# EAGLE design hbs (EAGLE 9.3.2)
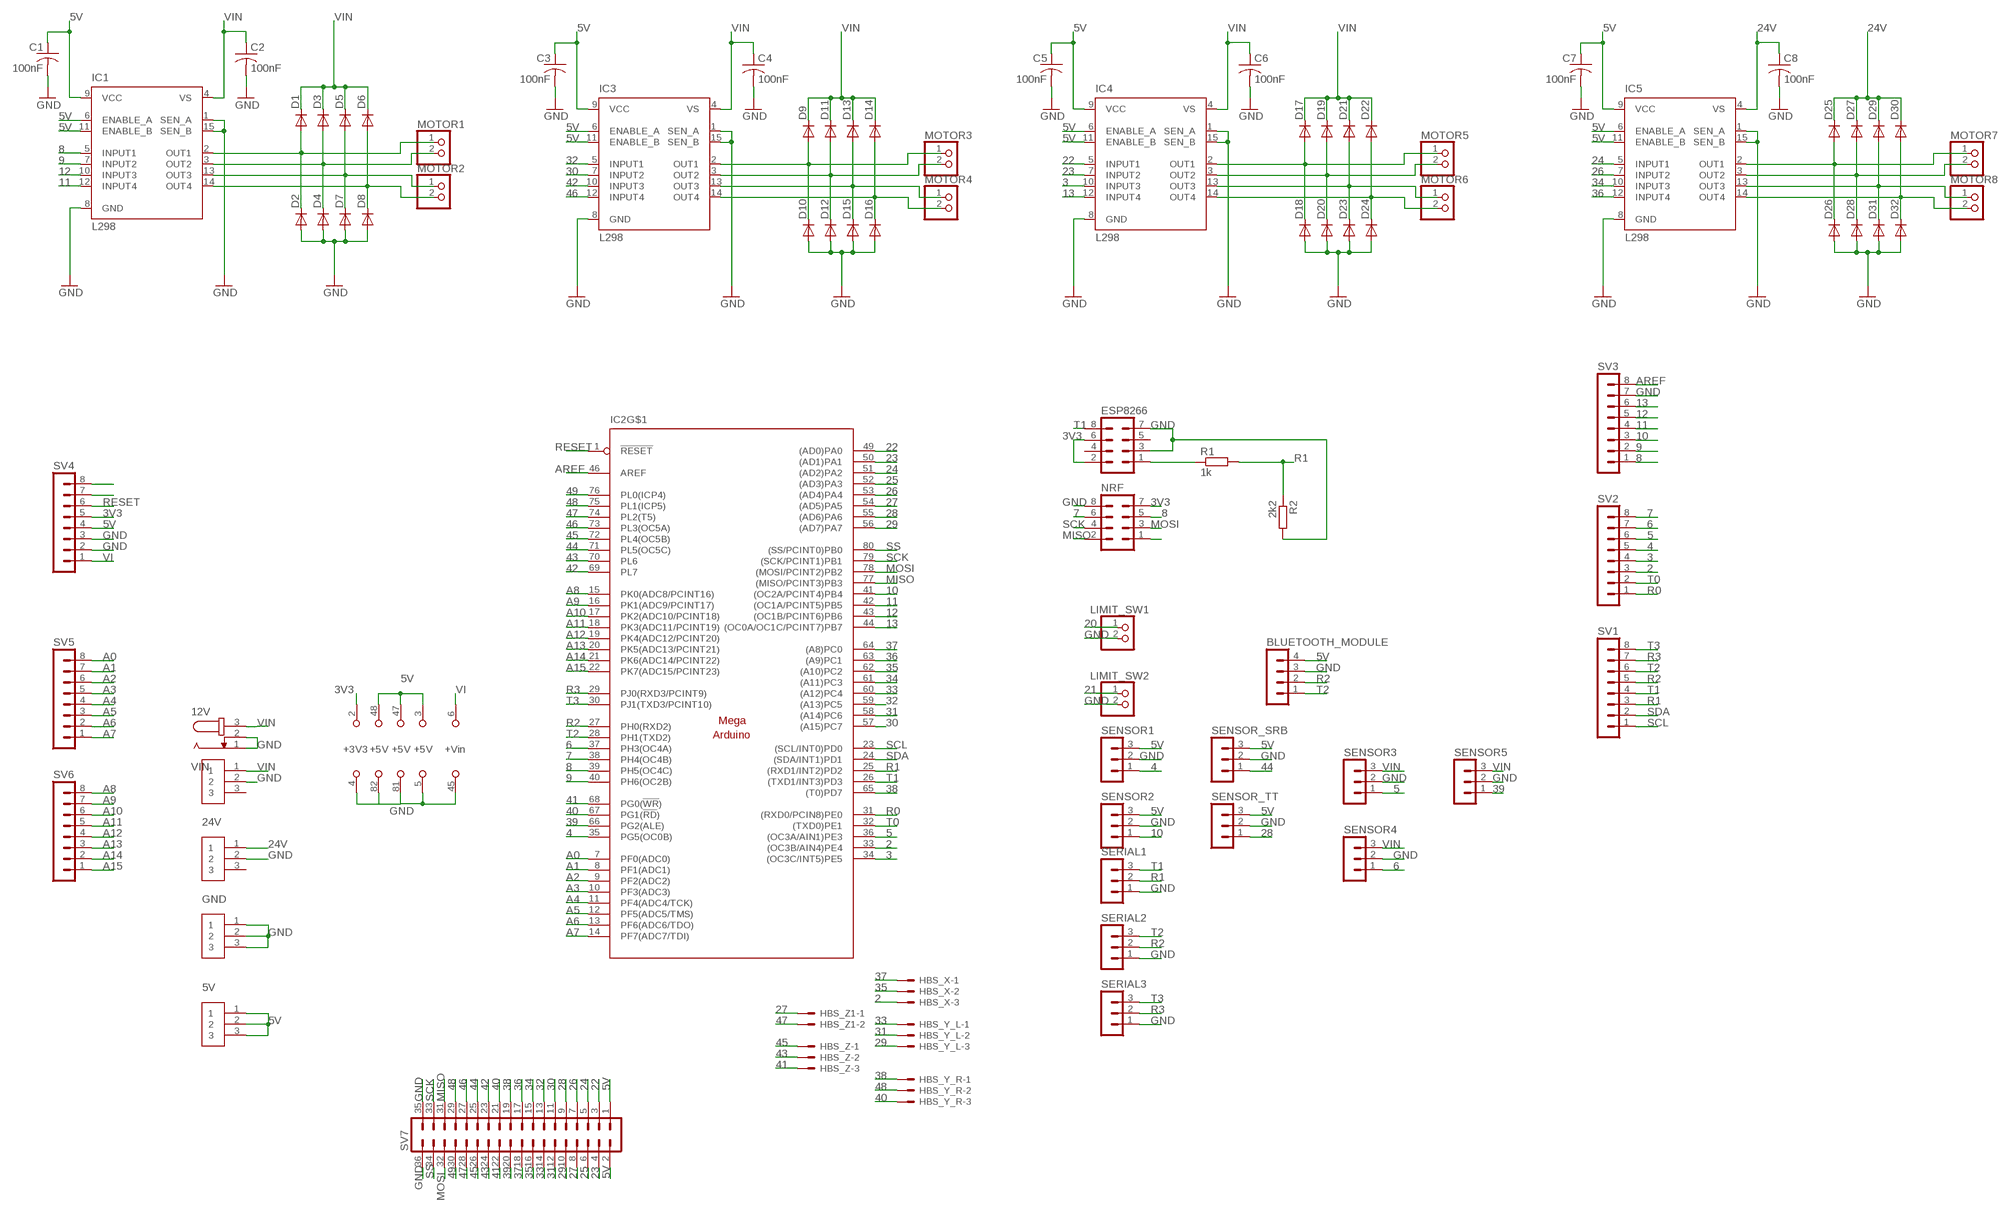
[diagram p0: schematic, sheet 1]

## Parts
5V  691311500003  [TERMINALBLOCK_PLUGGABLE-3-5.08MM]
12V  JACK-PLUG0  [SPC4077]
24V  691311500003  [TERMINALBLOCK_PLUGGABLE-3-5.08MM]
BLUETOOTH_MODULE  MA04-1  [MA04-1]
C1  100nF  C-US050-024X044  [C050-024X044]
C2  100nF  C-US050-024X044  [C050-024X044]
C3  100nF  C-US050-024X044  [C050-024X044]
C4  100nF  C-US050-024X044  [C050-024X044]
C5  100nF  C-US050-024X044  [C050-024X044]
C6  100nF  C-US050-024X044  [C050-024X044]
C7  100nF  C-US050-024X044  [C050-024X044]
C8  100nF  C-US050-024X044  [C050-024X044]
D1  DIODE-D-5  [D-5]
D2  DIODE-D-5  [D-5]
D3  DIODE-D-5  [D-5]
D4  DIODE-D-5  [D-5]
D5  DIODE-D-5  [D-5]
D6  DIODE-D-5  [D-5]
D7  DIODE-D-5  [D-5]
D8  DIODE-D-5  [D-5]
D9  DIODE-D-5  [D-5]
D10  DIODE-D-5  [D-5]
D11  DIODE-D-5  [D-5]
D12  DIODE-D-5  [D-5]
D13  DIODE-D-5  [D-5]
D14  DIODE-D-5  [D-5]
D15  DIODE-D-5  [D-5]
D16  DIODE-D-5  [D-5]
D17  DIODE-D-5  [D-5]
D18  DIODE-D-5  [D-5]
D19  DIODE-D-5  [D-5]
D20  DIODE-D-5  [D-5]
D21  DIODE-D-5  [D-5]
D22  DIODE-D-5  [D-5]
D23  DIODE-D-5  [D-5]
D24  DIODE-D-5  [D-5]
D25  DIODE-D-5  [D-5]
D26  DIODE-D-5  [D-5]
D27  DIODE-D-5  [D-5]
D28  DIODE-D-5  [D-5]
D29  DIODE-D-5  [D-5]
D30  DIODE-D-5  [D-5]
D31  DIODE-D-5  [D-5]
D32  DIODE-D-5  [D-5]
ESP8266  MA04-2  [MA04-2]
GND  691311500003  [TERMINALBLOCK_PLUGGABLE-3-5.08MM]
HBS_X  JST-XH-03-PIN-LONG-PAD  [JST-XH-03-PACKAGE-LONG-PAD]
HBS_Y_L  JST-XH-03-PIN-LONG-PAD  [JST-XH-03-PACKAGE-LONG-PAD]
HBS_Y_R  JST-XH-03-PIN-LONG-PAD  [JST-XH-03-PACKAGE-LONG-PAD]
HBS_Z  JST-XH-03-PIN-LONG-PAD  [JST-XH-03-PACKAGE-LONG-PAD]
HBS_Z1  JST-XH-02-PIN-LONG-PAD  [JST-XH-02-PACKAGE-LONG-PAD]
IC1  L298  [MULTIWATT-15]
IC2  MEGAARDUINO_21  [MEGA_ARDUINO_1]
IC3  L298  [MULTIWATT-15]
IC4  L298  [MULTIWATT-15]
IC5  L298  [MULTIWATT-15]
LIMIT_SW1  PINHD-1X2  [1X02]
LIMIT_SW2  PINHD-1X2  [1X02]
MOTOR1  PINHD-1X2  [1X02]
MOTOR2  PINHD-1X2  [1X02]
MOTOR3  PINHD-1X2  [1X02]
MOTOR4  PINHD-1X2  [1X02]
MOTOR5  PINHD-1X2  [1X02]
MOTOR6  PINHD-1X2  [1X02]
MOTOR7  PINHD-1X2  [1X02]
MOTOR8  PINHD-1X2  [1X02]
NRF  MA04-2  [MA04-2]
R1  1k  R-EU_0204/7  [0204/7]
R2  2k2  R-EU_0204/7  [0204/7]
SENSOR1  MA03-1  [MA03-1]
SENSOR2  MA03-1  [MA03-1]
SENSOR3  MA03-1  [MA03-1]
SENSOR4  MA03-1  [MA03-1]
SENSOR5  MA03-1  [MA03-1]
SENSOR_SRB  MA03-1  [MA03-1]
SENSOR_TT  MA03-1  [MA03-1]
SERIAL1  MA03-1  [MA03-1]
SERIAL2  MA03-1  [MA03-1]
SERIAL3  MA03-1  [MA03-1]
SV1  MA08-1  [MA08-1]
SV2  MA08-1  [MA08-1]
SV3  MA08-1  [MA08-1]
SV4  MA08-1  [MA08-1]
SV5  MA08-1  [MA08-1]
SV6  MA08-1  [MA08-1]
SV7  MA18-2  [MA18-2]
VIN  691311500003  [TERMINALBLOCK_PLUGGABLE-3-5.08MM]

## Nets
2: HBS_X.3 IC2.33((OC3B/AIN4)PE4) SV2.3
3: IC2.34((OC3C/INT5)PE5) IC4.10(INPUT3) SV2.4
3V3: ESP8266.2 ESP8266.6 IC2.2(+3V3) NRF.7 SV4.5
4: IC2.35(PG5(OC0B)) SENSOR1.1 SV2.5
5: IC2.36((OC3A/AIN1)PE3) SENSOR3.1 SV2.6
5V: 5V.1 5V.2 5V.3 BLUETOOTH_MODULE.4 C1.1 C3.1 C5.1 C7.1 IC1.6(ENABLE_A) IC1.9(VCC) IC1.11(ENABLE_B) IC2.3(+5V) IC2.47(+5V) IC2.48(+5V) IC3.6(ENABLE_A) IC3.9(VCC) IC3.11(ENABLE_B) IC4.6(ENABLE_A) IC4.9(VCC) IC4.11(ENABLE_B) IC5.6(ENABLE_A) IC5.9(VCC) IC5.11(ENABLE_B) SENSOR1.3 SENSOR2.3 SENSOR_SRB.3 SENSOR_TT.3 SV4.4 SV7.1 SV7.2
6: IC2.37(PH3(OC4A)) SENSOR4.1 SV2.7
7: IC2.38(PH4(OC4B)) NRF.6 SV2.8
8: IC1.5(INPUT1) IC2.39(PH5(OC4C)) NRF.5 SV3.1
9: IC1.7(INPUT2) IC2.40(PH6(OC2B)) SV3.2
10: IC2.41((OC2A/PCINT4)PB4) SENSOR2.1 SV3.3
11: IC1.12(INPUT4) IC2.42((OC1A/PCINT5)PB5) SV3.4
12: IC1.10(INPUT3) IC2.43((OC1B/PCINT6)PB6) SV3.5
13: IC2.44((OC0A/OC1C/PCINT7)PB7) IC4.12(INPUT4) SV3.6
20: LIMIT_SW1.1
21: LIMIT_SW2.1
22: IC2.49((AD0)PA0) IC4.5(INPUT1) SV7.3
23: IC2.50((AD1)PA1) IC4.7(INPUT2) SV7.4
24: IC2.51((AD2)PA2) IC5.5(INPUT1) SV7.5
24V: 24V.1 C8.1 D25.C D27.C D29.C D30.C IC5.4(VS)
25: IC2.52((AD3)PA3) SV7.6
26: IC2.53((AD4)PA4) IC5.7(INPUT2) SV7.7
27: HBS_Z1.1 IC2.54((AD5)PA5) SV7.8
28: IC2.55((AD6)PA6) SENSOR_TT.1 SV7.9
29: HBS_Y_L.3 IC2.56((AD7)PA7) SV7.10
30: IC2.57((A15)PC7) IC3.7(INPUT2) SV7.11
31: HBS_Y_L.2 IC2.58((A14)PC6) SV7.12
32: IC2.59((A13)PC5) IC3.5(INPUT1) SV7.13
33: HBS_Y_L.1 IC2.60((A12)PC4) SV7.14
34: IC2.61((A11)PC3) IC5.10(INPUT3) SV7.15
35: HBS_X.2 IC2.62((A10)PC2) SV7.16
36: IC2.63((A9)PC1) IC5.12(INPUT4) SV7.17
37: HBS_X.1 IC2.64((A8)PC0) SV7.18
38: HBS_Y_R.1 IC2.65((T0)PD7) SV7.19
39: IC2.66(PG2(ALE)) SENSOR5.1 SV7.20
40: HBS_Y_R.3 IC2.67(PG1(!RD!)) SV7.21
41: HBS_Z.3 IC2.68(PG0(!WR!)) SV7.22
42: IC2.69(PL7) IC3.10(INPUT3) SV7.23
43: HBS_Z.2 IC2.70(PL6) SV7.24
44: IC2.71(PL5(OC5C)) SENSOR_SRB.1 SV7.25
45: HBS_Z.1 IC2.72(PL4(OC5B)) SV7.26
46: IC2.73(PL3(OC5A)) IC3.12(INPUT4) SV7.27
47: HBS_Z1.2 IC2.74(PL2(T5)) SV7.28
48: HBS_Y_R.2 IC2.75(PL1(ICP5)) SV7.29
49: IC2.76(PL0(ICP4)) SV7.30
A0: IC2.7(PF0(ADC0)) SV5.8
A1: IC2.8(PF1(ADC1)) SV5.7
A2: IC2.9(PF2(ADC2)) SV5.6
A3: IC2.10(PF3(ADC3)) SV5.5
A4: IC2.11(PF4(ADC4/TCK)) SV5.4
A5: IC2.12(PF5(ADC5/TMS)) SV5.3
A6: IC2.13(PF6(ADC6/TDO)) SV5.2
A7: IC2.14(PF7(ADC7/TDI)) SV5.1
A8: IC2.15(PK0(ADC8/PCINT16)) SV6.8
A9: IC2.16(PK1(ADC9/PCINT17)) SV6.7
A10: IC2.17(PK2(ADC10/PCINT18)) SV6.6
A11: IC2.18(PK3(ADC11/PCINT19)) SV6.5
A12: IC2.19(PK4(ADC12/PCINT20)) SV6.4
A13: IC2.20(PK5(ADC13/PCINT21)) SV6.3
A14: IC2.21(PK6(ADC14/PCINT22)) SV6.2
A15: IC2.22(PK7(ADC15/PCINT23)) SV6.1
AREF: IC2.46(AREF) SV3.8
GND: 12V.1 12V.2 24V.2 BLUETOOTH_MODULE.3 C1.2 C2.2 C3.2 C4.2 C5.2 C6.2 C7.2 C8.2 D2.A D4.A D7.A D8.A D10.A D12.A D15.A D16.A D18.A D20.A D23.A D24.A D26.A D28.A D31.A D32.A ESP8266.3 ESP8266.7 GND.1 GND.2 GND.3 IC1.1(SEN_A) IC1.8(GND) IC1.15(SEN_B) IC2.4(GND) IC2.5(GND) IC2.45(GND) IC2.81(GND) IC2.82(GND) IC3.1(SEN_A) IC3.8(GND) IC3.15(SEN_B) IC4.1(SEN_A) IC4.8(GND) IC4.15(SEN_B) IC5.1(SEN_A) IC5.8(GND) IC5.15(SEN_B) LIMIT_SW1.2 LIMIT_SW2.2 NRF.8 R2.2 SENSOR1.2 SENSOR2.2 SENSOR3.2 SENSOR4.2 SENSOR5.2 SENSOR_SRB.2 SENSOR_TT.2 SERIAL1.1 SERIAL2.1 SERIAL3.1 SV3.7 SV4.2 SV4.3 SV7.35 SV7.36 VIN.2
MISO: IC2.77((MISO/PCINT3)PB3) NRF.2 SV7.31
MOSI: IC2.78((MOSI/PCINT2)PB2) NRF.3 SV7.32
N$1: D1.A D2.C IC1.2(OUT1) MOTOR1.1
N$2: D3.A D4.C IC1.3(OUT2) MOTOR1.2
N$3: D6.A D8.C IC1.14(OUT4) MOTOR2.2
N$4: D5.A D7.C IC1.13(OUT3) MOTOR2.1
N$5: ESP8266.1 R1.1
N$7: D9.A D10.C IC3.2(OUT1) MOTOR3.1
N$8: D11.A D12.C IC3.3(OUT2) MOTOR3.2
N$9: D14.A D16.C IC3.14(OUT4) MOTOR4.2
N$10: D13.A D15.C IC3.13(OUT3) MOTOR4.1
N$11: D17.A D18.C IC4.2(OUT1) MOTOR5.1
N$12: D19.A D20.C IC4.3(OUT2) MOTOR5.2
N$13: D22.A D24.C IC4.14(OUT4) MOTOR6.2
N$14: D21.A D23.C IC4.13(OUT3) MOTOR6.1
N$15: D25.A D26.C IC5.2(OUT1) MOTOR7.1
N$16: D27.A D28.C IC5.3(OUT2) MOTOR7.2
N$17: SV4.8
N$18: SV4.7
N$19: D30.A D32.C IC5.14(OUT4) MOTOR8.2
N$20: D29.A D31.C IC5.13(OUT3) MOTOR8.1
N$22: NRF.1
R0: IC2.31((RXD0/PCIN8)PE0) SV2.1
R1: IC2.25((RXD1/INT2)PD2) R1.2 R2.1 SERIAL1.2 SV1.3
R2: BLUETOOTH_MODULE.2 IC2.27(PH0(RXD2)) SERIAL2.2 SV1.5
R3: IC2.29(PJ0(RXD3/PCINT9)) SERIAL3.2 SV1.7
RESET: IC2.1(!RESET) SV4.6
SCK: IC2.79((SCK/PCINT1)PB1) NRF.4 SV7.33
SCL: IC2.23((SCL/INT0)PD0) SV1.1
SDA: IC2.24((SDA/INT1)PD1) SV1.2
SS: IC2.80((SS/PCINT0)PB0) SV7.34
T0: IC2.32((TXD0)PE1) SV2.2
T1: ESP8266.8 IC2.26((TXD1/INT3)PD3) SERIAL1.3 SV1.4
T2: BLUETOOTH_MODULE.1 IC2.28(PH1(TXD2)) SERIAL2.3 SV1.6
T3: IC2.30(PJ1(TXD3/PCINT10)) SERIAL3.3 SV1.8
VI: IC2.6(+VIN) SV4.1
VIN: 12V.3 C2.1 C4.1 C6.1 D1.C D3.C D5.C D6.C D9.C D11.C D13.C D14.C D17.C D19.C D21.C D22.C IC1.4(VS) IC3.4(VS) IC4.4(VS) SENSOR3.3 SENSOR4.3 SENSOR5.3 VIN.1
Unconnected: 24V.3 ESP8266.4 ESP8266.5 VIN.3

## Library data of the parts
5V 24V GND VIN = Terminal Blocks:691311500003: 5.08MM OPEN VERTICAL PCB HEADER WR-TBL Manufacturer's datasheet <https://katalog.we-online.com/em/datasheet/6913115000xx.pdf>; CREATED_BY: PCBLayout.com; DIGIKEY_PART_NO: 732-2053-ND; MANUFACTURER: WURTH ELEKTRONIK; MPN: 691311500003
12V = con-jack:JACK-PLUG: DC POWER JACK Power Jack, DC, Right Angle, Through Hole, Rated 5A at 16VDC, PC Terminals Distributor: Farnell (www.Farnell.de) Drawing: 84N1161.pdf / 84N1162.pdf Manufacturer: SPC Technology (www.spctechnology.com) Type: SPC4077 / SPC 4078; OC_FARNELL: unknown; OC_NEWARK: unknown
BLUETOOTH_MODULE = con-lstb:MA04-1: PIN HEADER; OC_FARNELL: unknown; OC_NEWARK: unknown
C1-C8 = rcl:C-US: CAPACITOR, American symbol
D1-D32 = diode:DIODE-: DIODE
ESP8266 NRF = con-lstb:MA04-2: PIN HEADER; OC_FARNELL: unknown; OC_NEWARK: unknown
HBS_X HBS_Y_L HBS_Y_R HBS_Z = Rembrandt Electronics - JST XH Connectors v1-0:JST-XH-03-PIN: JST XH Connector 2 Pin Wire to board connector. Pitch: 2,54 mm, (0.100") Number of pins: 3 Created by Rembrandt Electronics www.rembrandtelectronics.com
HBS_Z1 = Rembrandt Electronics - JST XH Connectors v1-0:JST-XH-02-PIN: JST XH Connector 2 Pin Wire to board connector. Pitch: 2,54 mm, (0.100") Number of pins: 2 Created by Rembrandt Electronics www.rembrandtelectronics.com
IC1 IC3-IC5 = st-microelectronics:L298: DUAL FULL-BRIDGE DRIVER; MPN: L298N; OC_FARNELL: 1589425; OC_NEWARK: 32M1527
IC2 = arduino:MEGAARDUINO_2: The Arduino Mega is a microcontroller board based on the ATmega1280. - 54 digital input/output pins (of which 14 can be used as PWM outputs) - 16 analog inputs - 4 UARTs (hardware serial ports) - 16 MHz crystal oscillator - USB connection - power jack - ICSP header - reset button It contains everything needed to support the microcontroller; simply connect it to a computer with a USB cable or power it with a AC-to-DC adapter or battery to get started. The Mega is compatible with most shields designed for the Arduino Duemilanove or Diecimila. http://arduino.cc/en/Main/ArduinoBoardMega
LIMIT_SW1 LIMIT_SW2 MOTOR1-MOTOR8 = pinhead:PINHD-1X2: PIN HEADER
R1 R2 = rcl:R-EU_: RESISTOR, European symbol; SPICEPREFIX: R
SENSOR1-SENSOR5 SENSOR_SRB SENSOR_TT SERIAL1-SERIAL3 = con-lstb:MA03-1: PIN HEADER; OC_FARNELL: unknown; OC_NEWARK: unknown
SV1-SV6 = con-lstb:MA08-1: PIN HEADER; OC_FARNELL: unknown; OC_NEWARK: unknown
SV7 = con-lstb:MA18-2: PIN HEADER; OC_FARNELL: unknown; OC_NEWARK: unknown

## Board
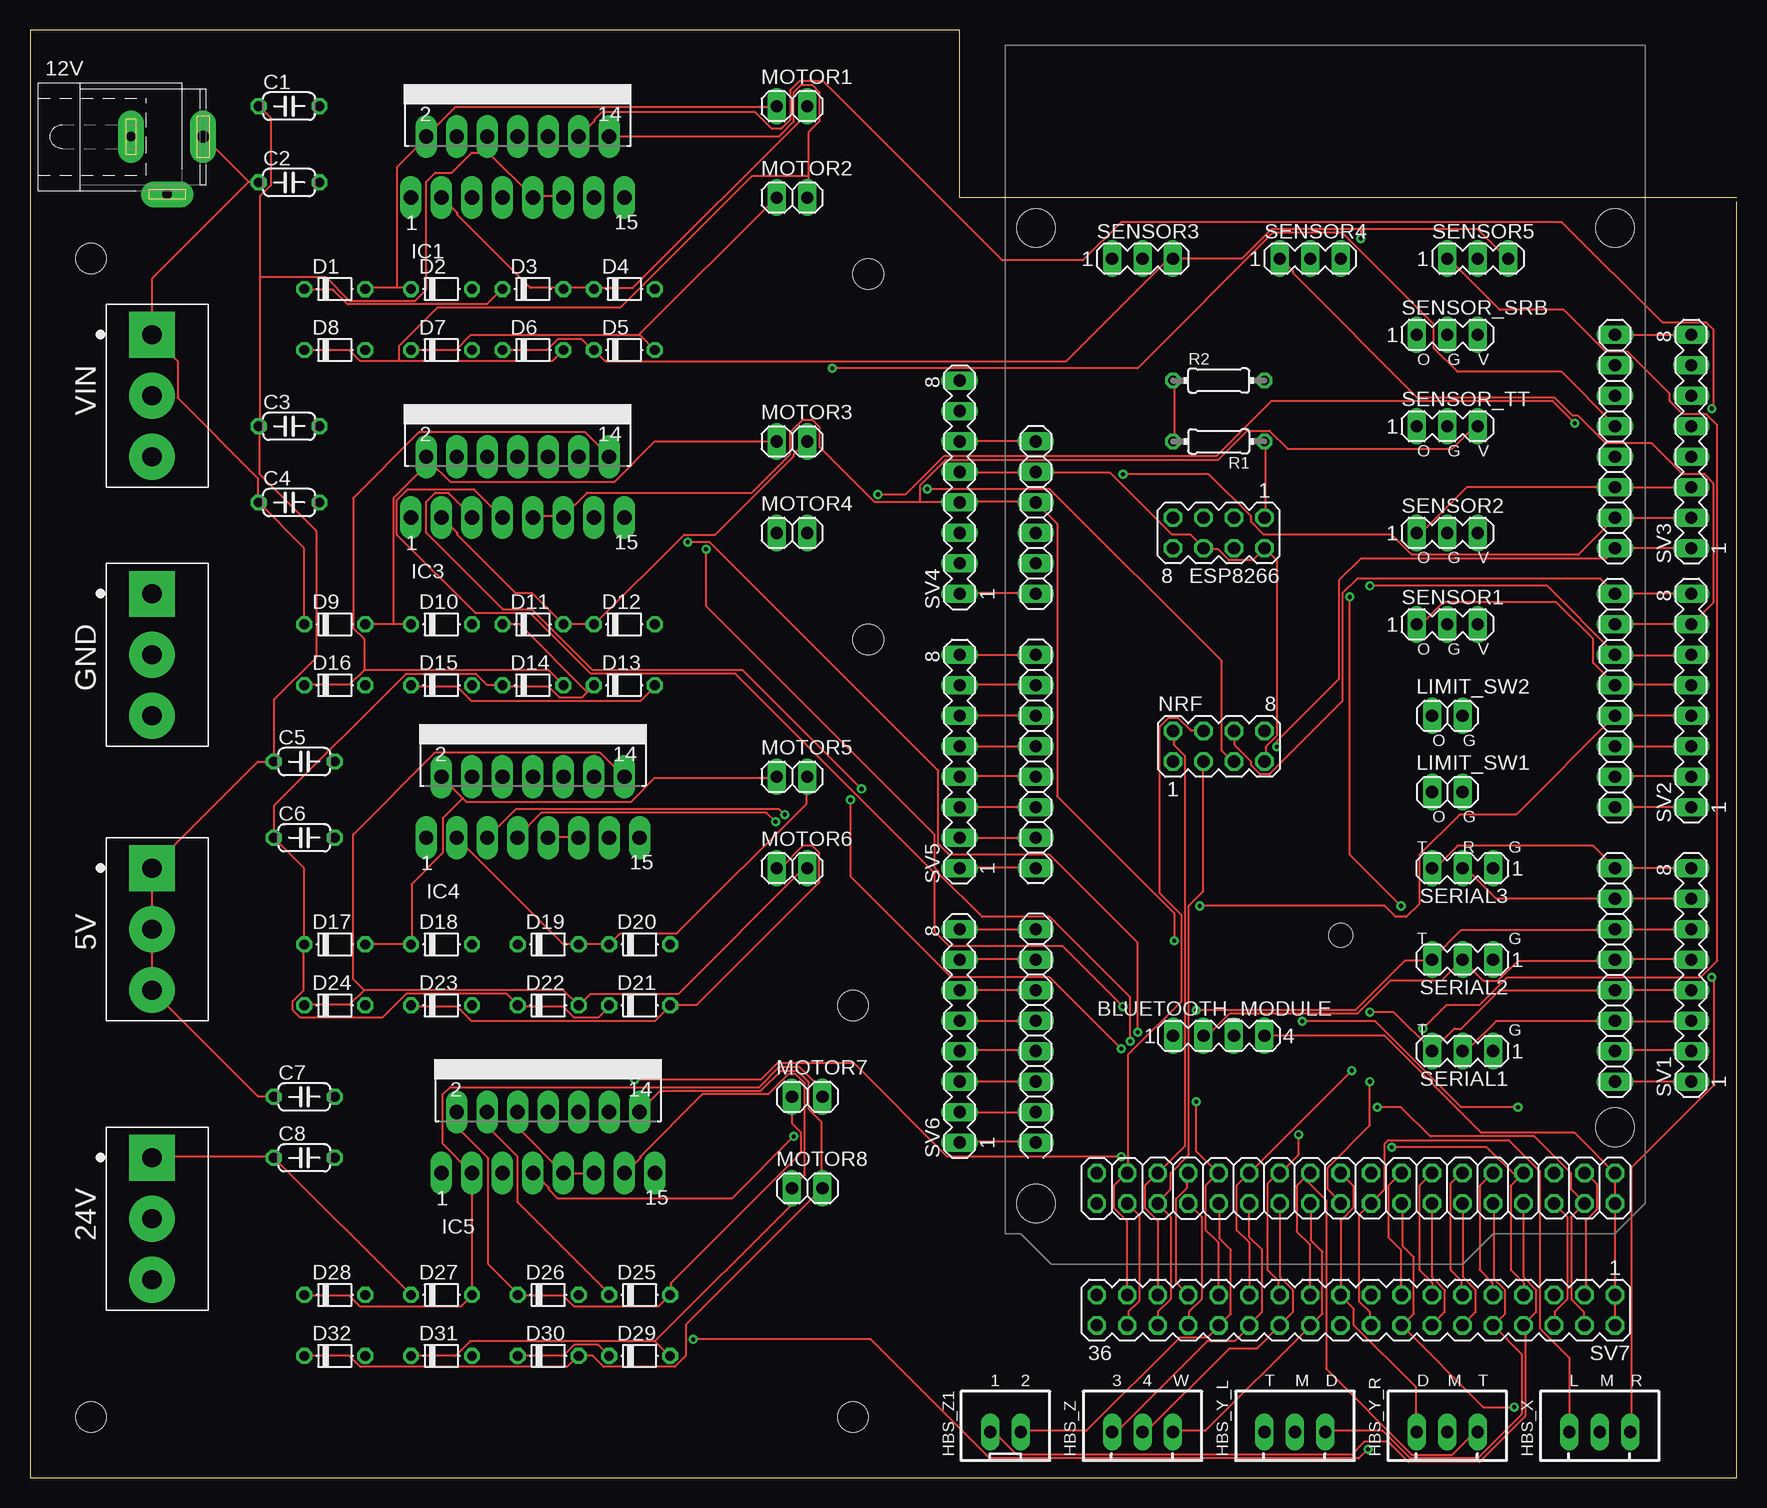
[diagram p1: board, top side]
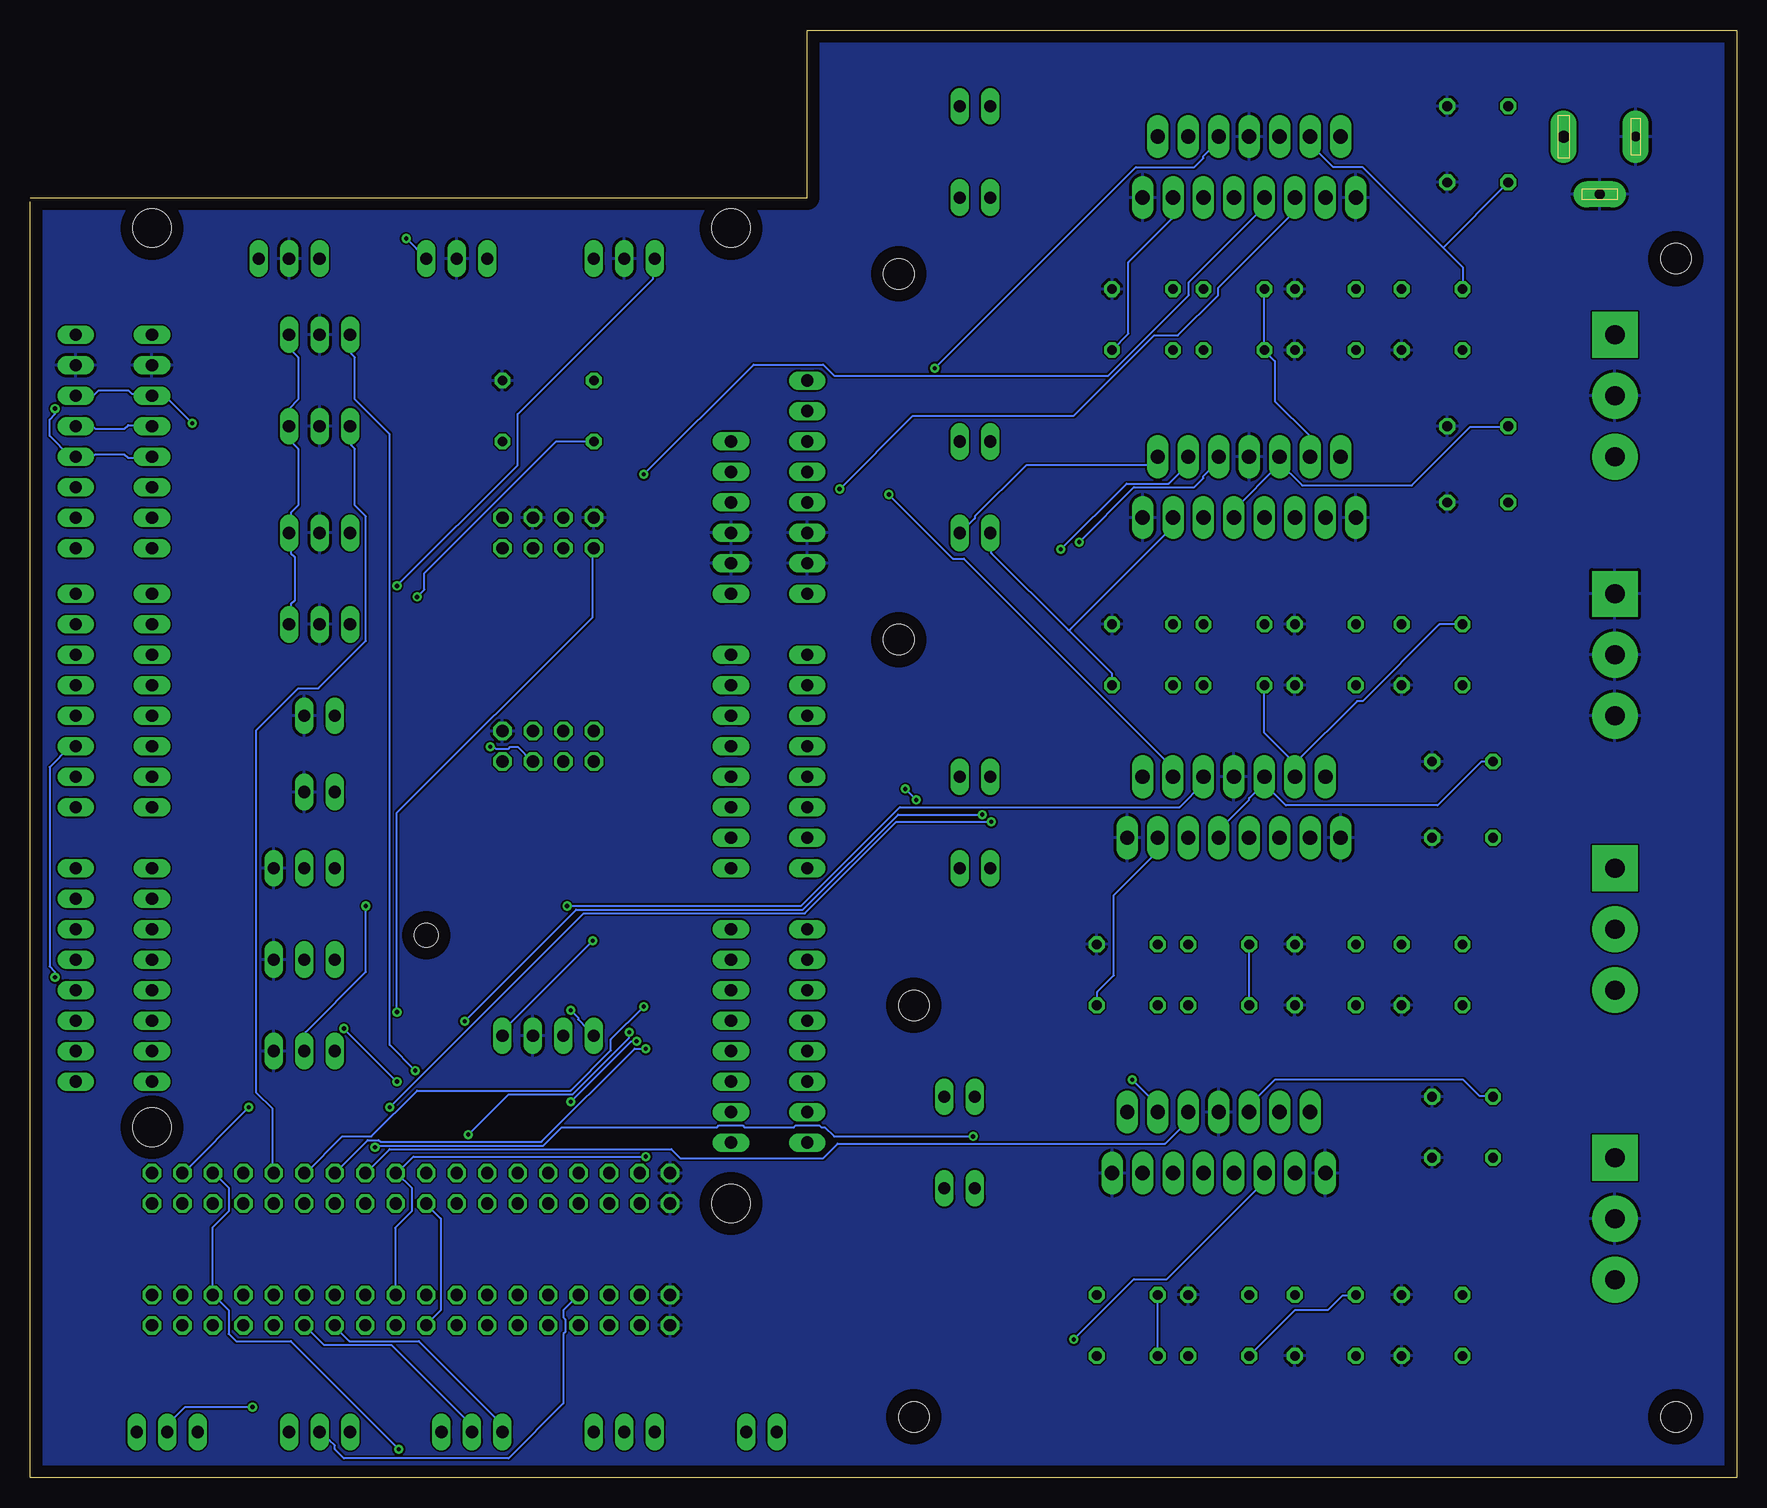
[diagram p2: board, bottom side, seen from below]

Size 142.24 x 120.65 mm. Coordinates in mm from the lower left corner, seen from the top.
Outline: 142.22,106.35 142.22,0 0,0 0,120.65 77.47,120.65 77.47,106.68 142.24,106.68
Copper layers (1*16): Top 0.035mm / dielectric 1.5mm / Bottom 0.035mm
Design rules "default": minimum track width 6mil, minimum drill 0.35mm, track to track 6mil, track to pad 6mil, pad to pad 6mil, via to via 6mil, smd to smd 6mil, copper to edge 40mil, drill to drill 6mil, minimum pad ring 10mil, minimum via ring 8mil, stop-mask expansion 4mil, vias tented up to drill 0mil, thermal gap 10mil
Holes 2.54 mm at 5.08,5.08 5.08,101.6 69.85,100.33 68.58,5.08 68.58,39.37 69.85,69.85

### Footprints (pad centres in the part's own frame; a part is rotated, then mirrored left to right if it is on the bottom)
TERMINALBLOCK_PLUGGABLE-3-5.08MM = drill 1.6 pad 3.81 square: 1 -5.08,0 | drill 1.6 pad 3.81: 2 0,0; 3 5.08,0
SPC4077 = drill 0.8 pad 2.184 long: 1 -3,0; 2 0,-4.8 | drill 1 pad 2.184 long: 3 3,0
MA04-1 = drill 1.016 long: 1 -3.81,0; 2 -1.27,0; 3 1.27,0; 4 3.81,0
C050-024X044 = drill 0.813 octagon: 1 -2.54,0; 2 2.54,0
D-5 = drill 0.813 octagon: A 2.54,0; C -2.54,0
MA04-2 = drill 1.016 octagon: 1 -3.81,-1.27; 2 -3.81,1.27; 3 -1.27,-1.27; 4 -1.27,1.27; 5 1.27,-1.27; 6 1.27,1.27; 7 3.81,-1.27; 8 3.81,1.27
JST-XH-03-PACKAGE-LONG-PAD = drill 1.016 long: 1 -2.54,0; 2 0,0; 3 2.54,0
JST-XH-02-PACKAGE-LONG-PAD = drill 1.016 long: 1 -1.27,0; 2 1.27,0
MULTIWATT-15 = drill 1.2 long: 1 -8.89,-7.62; 2 -7.62,-2.54; 3 -6.35,-7.62; 4 -5.08,-2.54; 5 -3.81,-7.62; 6 -2.54,-2.54; 7 -1.27,-7.62; 8 0,-2.54; 9 1.27,-7.62; 10 2.54,-2.54; 11 3.81,-7.62; 12 5.08,-2.54; 13 6.35,-7.62; 14 7.62,-2.54; 15 8.89,-7.62
MEGA_ARDUINO_1 = drill 1.016 long: 1 33.02,2.54; 2 35.56,2.54; 3 38.1,2.54; 4 40.64,2.54; 5 43.18,2.54; 6 45.72,2.54; 7 50.8,2.54; 8 53.34,2.54; 9 55.88,2.54; 10 58.42,2.54; 11 60.96,2.54; 12 63.5,2.54; 13 66.04,2.54; 14 68.58,2.54; 15 73.66,2.54; 16 76.2,2.54; 17 78.74,2.54; 18 81.28,2.54; 19 83.82,2.54; 20 86.36,2.54; 21 88.9,2.54; 22 91.44,2.54; 23 86.36,50.8; 24 83.82,50.8; 25 81.28,50.8; 26 78.74,50.8; 27 76.2,50.8; 28 73.66,50.8; 29 71.12,50.8; 30 68.58,50.8; 31 63.5,50.8; 32 60.96,50.8; 33 58.42,50.8; 34 55.88,50.8; 35 53.34,50.8; 36 50.8,50.8; 37 48.26,50.8; 38 45.72,50.8; 39 41.91,50.8; 40 39.37,50.8; 41 36.83,50.8; 42 34.29,50.8; 43 31.75,50.8; 44 29.21,50.8; 45 26.67,50.8; 46 24.13,50.8 | drill 1.016 octagon: 47 93.98,50.8; 48 96.52,50.8; 49 93.98,48.26; 50 96.52,48.26; 51 93.98,45.72; 52 96.52,45.72; 53 93.98,43.18; 54 96.52,43.18; 55 93.98,40.64; 56 96.52,40.64; 57 93.98,38.1; 58 96.52,38.1; 59 93.98,35.56; 60 96.52,35.56; 61 93.98,33.02; 62 96.52,33.02; 63 93.98,30.48; 64 96.52,30.48; 65 93.98,27.94; 66 96.52,27.94; 67 93.98,25.4; 68 96.52,25.4; 69 93.98,22.86; 70 96.52,22.86; 71 93.98,20.32; 72 96.52,20.32; 73 93.98,17.78; 74 96.52,17.78; 75 93.98,15.24; 76 96.52,15.24; 77 93.98,12.7; 78 96.52,12.7; 79 93.98,10.16; 80 96.52,10.16; 81 93.98,7.62; 82 96.52,7.62 | hole 3.2: 15.24,50.8; 15.24,2.54; 90.17,50.8; 96.52,2.54 | hole 2: 74.168,27.94
1X02 = drill 1.016 long: 1 -1.27,0; 2 1.27,0
0204/7 = drill 0.813 octagon: 1 -3.81,0; 2 3.81,0
MA03-1 = drill 1.016 long: 1 -2.54,0; 2 0,0; 3 2.54,0
MA08-1 = drill 1.016 long: 1 -8.89,0; 2 -6.35,0; 3 -3.81,0; 4 -1.27,0; 5 1.27,0; 6 3.81,0; 7 6.35,0; 8 8.89,0
MA18-2 = drill 1.016 octagon: 1 -21.59,-1.27; 2 -21.59,1.27; 3 -19.05,-1.27; 4 -19.05,1.27; 5 -16.51,-1.27; 6 -16.51,1.27; 7 -13.97,-1.27; 8 -13.97,1.27; 9 -11.43,-1.27; 10 -11.43,1.27; 11 -8.89,-1.27; 12 -8.89,1.27; 13 -6.35,-1.27; 14 -6.35,1.27; 15 -3.81,-1.27; 16 -3.81,1.27; 17 -1.27,-1.27; 18 -1.27,1.27; 19 1.27,-1.27; 20 1.27,1.27; 21 3.81,-1.27; 22 3.81,1.27; 23 6.35,-1.27; 24 6.35,1.27; 25 8.89,-1.27; 26 8.89,1.27; 27 11.43,-1.27; 28 11.43,1.27; 29 13.97,-1.27; 30 13.97,1.27; 31 16.51,-1.27; 32 16.51,1.27; 33 19.05,-1.27; 34 19.05,1.27; 35 21.59,-1.27; 36 21.59,1.27

### Placement (x,y rotation side)
5V  10.16,45.72 270 top
12V  11.43,111.76 0 top
24V  10.16,21.59 270 top
BLUETOOTH_MODULE  99.06,36.83 0 top
C1  21.59,114.3 0 top
C2  21.59,107.95 0 top
C3  21.59,87.63 0 top
C4  21.59,81.28 0 top
C5  22.86,59.69 0 top
C6  22.86,53.34 0 top
C7  22.86,31.75 0 top
C8  22.86,26.67 0 top
D1  25.4,99.06 0 top
D2  34.29,99.06 0 top
D3  41.91,99.06 0 top
D4  49.53,99.06 0 top
D5  49.53,93.98 0 top
D6  41.91,93.98 0 top
D7  34.29,93.98 0 top
D8  25.4,93.98 0 top
D9  25.4,71.12 0 top
D10  34.29,71.12 0 top
D11  41.91,71.12 0 top
D12  49.53,71.12 0 top
D13  49.53,66.04 0 top
D14  41.91,66.04 0 top
D15  34.29,66.04 0 top
D16  25.4,66.04 0 top
D17  25.4,44.45 0 top
D18  34.29,44.45 0 top
D19  43.18,44.45 0 top
D20  50.8,44.45 0 top
D21  50.8,39.37 0 top
D22  43.18,39.37 0 top
D23  34.29,39.37 0 top
D24  25.4,39.37 0 top
D25  50.8,15.24 0 top
D26  43.18,15.24 0 top
D27  34.29,15.24 0 top
D28  25.4,15.24 0 top
D29  50.8,10.16 0 top
D30  43.18,10.16 0 top
D31  34.29,10.16 0 top
D32  25.4,10.16 0 top
ESP8266  99.06,78.74 180 top
GND  10.16,68.58 270 top
HBS_X  130.81,3.81 0 top
HBS_Y_L  105.41,3.81 0 top
HBS_Y_R  118.11,3.81 0 top
HBS_Z  92.71,3.81 0 top
HBS_Z1  81.28,3.81 0 top
IC1  40.64,114.3 0 top
IC2  81.28,119.38 270 top
IC3  40.64,87.63 0 top
IC4  41.91,60.96 0 top
IC5  43.18,33.02 0 top
LIMIT_SW1  118.11,57.15 0 top
LIMIT_SW2  118.11,63.5 0 top
MOTOR1  63.5,114.3 0 top
MOTOR2  63.5,106.68 0 top
MOTOR3  63.5,86.36 0 top
MOTOR4  63.5,78.74 0 top
MOTOR5  63.5,58.42 0 top
MOTOR6  63.5,50.8 0 top
MOTOR7  64.77,31.75 0 top
MOTOR8  64.77,24.13 0 top
NRF  99.06,60.96 0 top
R1  99.06,86.36 180 top
R2  99.06,91.44 0 top
SENSOR1  118.11,71.12 0 top
SENSOR2  118.11,78.74 0 top
SENSOR3  92.71,101.6 0 top
SENSOR4  106.68,101.6 0 top
SENSOR5  120.65,101.6 0 top
SENSOR_SRB  118.11,95.25 0 top
SENSOR_TT  118.11,87.63 0 top
SERIAL1  119.38,35.56 180 top
SERIAL2  119.38,43.18 180 top
SERIAL3  119.38,50.8 180 top
SV1  138.43,41.91 90 top
SV2  138.43,64.77 90 top
SV3  138.43,86.36 90 top
SV4  77.47,82.55 90 top
SV5  77.47,59.69 90 top
SV6  77.47,36.83 90 top
SV7  110.49,13.97 180 top
VIN  10.16,90.17 270 top

### Tracks (layer width: path | path; a pad name or v marks a point on that pad's centre or on a via)
2  (via drill 0.35)
  Top 0.152: v140.16,41.71 140.31,41.55 140.31,32.72 133.45,25.86 133.45,3.91 HBS_X.3 | IC2.33 132.08,60.91 138.33,60.91 SV2.3
  Bottom 0.152: v140.16,41.71 140.16,42.16 140.61,42.62 140.61,59.23 138.94,60.91 138.48,60.91 SV2.3
3  (via drill 0.35)
  Top 0.152: SV2.4 IC2.34 123.85,55.27 119.13,55.27 115.77,51.92 115.77,47.8 114.71,46.74 113.79,46.74 112.88,47.65 v97.48,47.65
  Bottom 0.152: IC4.10 44.45,57.86 46.43,55.88 69.75,55.88 77.98,47.65 v97.48,47.65
3V3
  Top 0.152: SV4.5 77.52,83.77 83.77,83.77 IC2.2 83.92,83.77 90.02,83.77 95.2,78.59 96.72,78.59 97.79,77.52 ESP8266.6 97.79,77.37 99.01,77.37 99.92,76.45 101.91,76.45 102.82,77.37 ESP8266.2 103.89,76.45 103.89,61.82 102.97,60.91 102.97,59.69 NRF.7
4
  Top 0.152: 132.08,66.09 138.33,66.09 SV2.5 | SENSOR1.1 115.93,71.12 117.75,72.95 127.2,72.95 130.25,69.9 130.25,67.92 132.08,66.09 | 132.08,66.09 IC2.35
5  (via drill 0.35)
  Top 0.152: v111.66,74.32 126.44,74.32 132.08,68.68 IC2.36 132.08,68.53 138.33,68.53 SV2.6
  Bottom 0.152: SENSOR3.1 90.17,100.23 90.32,100.08 90.32,99.92 101.6,88.65 101.6,84.38 v111.66,74.32
5V  (via drill 0.35)
  Top 0.152: IC5.6 40.64,29.21 IC5.9 IC5.11 | C7.1 20.22,31.8 19,31.8 5V.3 5V.2 5V.1 10.16,50.85 19,59.69 C5.1 20.37,59.69 20.37,64.87 23.88,68.38 23.88,78.89 19.15,83.62 19.15,87.58 C3.1 19.15,87.73 19.15,100.08 | IC1.11 44.45,106.78 42.01,106.78 IC1.9 41.86,106.78 38.2,110.44 | 38.2,110.44 38.2,111.66 IC1.6 38.2,110.44 | 19.15,100.08 19.15,106.78 20.07,107.7 20.07,113.34 19.15,114.25 C1.1 | 38.2,110.44 36.83,110.44 35.15,108.76 33.78,108.76 33.02,108 33.02,99.01 32.11,98.09 26.62,98.09 24.64,100.08 19.15,100.08 | IC4.11 45.67,53.44 43.23,53.44 IC4.9 | SV7.2 SV7.1 IC2.48 IC2.47 128.73,28.75 120.95,28.75 112.88,36.83 BLUETOOTH_MODULE.4 | 44.45,80.11 42.01,80.11 IC3.9 | 74.17,81.33 70.36,81.33 65.79,85.9 65.79,87.58 65.18,88.19 64.41,88.19 63.35,87.12 63.35,85.29 60.15,82.09 46.43,82.09 44.45,80.11 | 74.17,81.33 77.37,81.33 SV4.4 77.52,81.33 83.77,81.33 IC2.3 85.6,79.5 85.6,56.79 95.35,47.04 v95.35,44.75 | 44.45,80.11 IC3.11 | 74.17,81.33 74.17,82.7 76.3,84.84 99.01,84.84 101.45,87.27 103.28,87.27 104.8,85.75 118.52,85.75 120.35,87.58 120.65,87.58 SENSOR_TT.3
  Bottom 0.152: IC5.6 40.64,31.04 38.51,33.17 22.81,33.17 21.44,31.8 20.37,31.8 C7.1 | 39.42,57.86 39.42,58.32 IC4.6 39.42,57.86 | 39.42,57.86 40.64,56.64 40.64,56.49 43.08,54.05 43.08,53.44 IC4.9 | 39.42,57.86 37.59,56.03 24.94,56.03 21.29,59.69 C5.1 | SENSOR1.3 120.65,72.49 120.5,72.64 120.5,72.8 120.19,73.1 120.19,76.76 120.5,77.06 120.5,78.59 SENSOR2.3 120.65,80.11 120.5,80.26 120.5,80.42 119.89,81.03 119.89,85.75 120.65,86.51 SENSOR_TT.3 120.65,89.1 119.89,89.87 119.89,93.37 120.65,94.13 SENSOR_SRB.3 | 38.2,84.68 38.2,84.38 41.86,80.72 41.86,80.11 IC3.9 | 38.2,84.68 38.2,84.99 IC3.6 38.2,84.68 | v95.35,44.75 102.82,37.29 102.82,36.83 BLUETOOTH_MODULE.4 | 38.2,84.68 36.22,82.7 27.08,82.7 22.2,87.58 19.15,87.58 C3.1
6
  Top 0.152: SENSOR4.1 104.19,101.6 105.26,100.53 105.26,100.38 115.62,90.02 127.05,90.02 128.57,88.49 129.03,88.49 131.32,86.21 135.13,86.21 137.72,83.62 139.55,83.62 140.31,82.86 140.31,72.95 138.48,71.12 SV2.7 IC2.37
7
  Top 0.152: 132.08,73.71 130.86,74.93 110.59,74.93 109.37,73.71 109.37,64.72 103.28,58.62 102.51,58.62 101.75,59.39 101.75,59.69 100.38,61.06 100.38,62.13 NRF.6 | 132.08,73.71 138.33,73.71 SV2.8 | 132.08,73.71 IC2.38
8  (via drill 0.35)
  Top 0.152: v103.89,60.91 103.89,61.37 109.07,66.55 109.07,74.78 110.9,76.61 131.32,76.61 132.08,77.37 IC2.39 132.08,77.52 138.33,77.52 SV3.1 | v74.78,82.4 84.99,82.4 99.31,68.07 99.31,60.6 100.23,59.69 NRF.5
  Bottom 0.152: v103.89,60.91 103.58,60.91 103.43,60.76 102.36,60.76 102.21,60.91 101.6,60.91 100.38,59.69 NRF.5 | IC1.5 36.83,105.56 43.23,99.16 43.23,98.55 46.58,95.2 48.57,95.2 55.27,88.49 68.68,88.49 v74.78,82.4
9  (via drill 0.35)
  Top 0.152: 132.08,79.96 138.33,79.96 SV3.2 | v91.08,83.62 98.25,83.62 101.75,80.11 101.75,79.65 102.82,78.59 113.49,78.59 115.16,76.91 129.03,76.91 132.08,79.96 | 132.08,79.96 IC2.40
  Bottom 0.152: v91.08,83.62 81.94,92.76 76.15,92.76 75.23,91.85 52.38,91.85 45.67,98.55 45.67,99.62 39.42,105.87 39.42,106.63 IC1.7
10
  Top 0.152: SENSOR2.1 115.93,78.74 119.74,82.55 IC2.41 SV3.3
11  (via drill 0.35)
  Top 0.152: v140.16,89.1 140.31,89.26 140.31,95.66 139.7,96.27 136.04,96.27 127.66,104.65 90.93,104.65 87.73,101.45 81.03,101.45 66.09,116.38 64.11,116.38 63.35,115.62 63.35,113.18 62.59,112.42 61.82,112.42 60.45,113.79 47.65,113.79 47.04,113.18 47.04,113.03 45.82,111.81 IC1.12
  Bottom 0.152: IC2.42 132.08,84.99 134.06,84.99 134.37,85.29 136.8,85.29 136.96,85.14 138.33,85.14 SV3.4 138.48,85.14 138.94,85.14 140.61,86.82 140.61,88.19 140.16,88.65 v140.16,89.1
12  (via drill 0.35)
  Top 0.152: v66.85,92.46 92.3,92.46 103.58,103.73 109.37,103.73 116.99,96.11 116.99,94.13 118.97,92.15 127.66,92.15 132.08,87.73 IC2.43
  Bottom 0.152: IC2.43 132.08,87.73 134.06,87.73 134.37,87.43 136.8,87.43 136.96,87.58 138.33,87.58 SV3.5 | v66.85,92.46 50.09,109.22 45.21,109.22 44.45,109.98 44.45,110.13 43.23,111.35 43.23,111.66 IC1.10
13  (via drill 0.35)
  Top 0.152: v70.66,81.94 72.95,81.94 76.15,85.14 98.86,85.14 103.43,89.71 126.9,89.71 v128.73,87.88
  Bottom 0.152: SV3.6 136.96,90.17 136.5,90.63 134.06,90.63 133.76,90.32 133.6,90.32 133.45,90.17 IC2.44 131.01,90.17 v128.73,87.88 | v70.66,81.94 65.33,76.61 64.41,76.61 47.04,59.23 47.04,58.47 IC4.12
22  (via drill 0.35)
  Top 0.152: SV7.3 129.64,15.34 129.64,21.44 130.56,22.35 130.56,24.49 129.64,25.4 IC2.49 | IC4.5 40.49,55.73 62.43,55.73 v62.89,55.27 | v106.02,38.05 112.12,38.05 119.28,30.89 v124,30.89
  Bottom 0.152: v62.89,55.27 69.9,55.27 77.83,47.35 96.72,47.35 v106.02,38.05 | v124,30.89 129.49,25.4 IC2.49
23  (via drill 0.35)
  Top 0.152: SV7.4 129.49,12.75 129.49,13.82 128.42,14.88 128.42,21.74 IC2.50 129.49,22.96 128.42,24.03 128.42,25.4 125.37,28.45 116.69,28.45 114.25,30.89 v112.27,30.89 | v62.13,54.66 61.37,55.42 42.62,55.42 40.64,53.44 IC4.7
  Bottom 0.152: v62.13,54.66 70.05,54.66 77.67,47.04 96.11,47.04 v112.27,30.89
24  (via drill 0.35)
  Top 0.152: v55.27,11.53 70.05,11.53 79.96,1.63 110.74,1.63 v111.51,2.39
  Bottom 0.152: IC2.51 126.9,25.4 125.68,24.18 125.68,22.2 127.05,20.83 127.05,15.34 SV7.5 126.9,15.19 125.68,13.97 125.68,11.99 125.07,11.38 120.5,11.38 v111.51,2.39 | v55.27,11.53 50.24,16.56 47.5,16.56 39.42,24.64 39.42,25.4 IC5.5
24V
  Top 0.152: D30.C 44.45,10.16 45.36,11.07 47.35,11.07 D29.C | IC5.4 38.2,30.43 38.2,29.21 40.64,26.77 40.64,22.96 48.26,15.34 D25.C | D27.C C8.1 20.22,26.77 10.16,26.77 24V.1
  Bottom 0.152: D29.C D25.C | D30.C 36.83,13.97 34.09,13.97 32.87,15.19 31.8,15.19 D27.C
25
  Top 0.152: IC2.52 128.12,21.74 128.12,14.88 127.05,13.82 127.05,12.75 SV7.6
26  (via drill 0.35)
  Top 0.152: SV7.7 124.46,16.26 123.39,17.32 123.39,24.33 124,24.94 | v63.65,28.45 58.47,23.27 43.99,23.27 43.23,24.03 43.23,24.18 42.01,25.4 IC5.7 | v113.49,27.53 121.41,27.53 124,24.94 | 124,24.94 IC2.53
  Bottom 0.152: v63.65,28.45 75.23,28.45 76,29.21 76.3,29.21 76.45,29.36 78.44,29.36 78.59,29.21 82.7,29.21 82.86,29.36 84.84,29.36 84.99,29.21 97.94,29.21 99.47,27.69 113.33,27.69 v113.49,27.53
27
  Top 0.152: HBS_Z1.1 80.11,3.76 80.42,3.76 82.24,1.93 110.13,1.93 111.2,3 113.18,3 114.86,1.32 120.8,1.32 124.61,5.13 124.61,12.45 124.46,12.6 SV7.8 124.46,12.75 125.53,13.82 125.53,15.65 124.46,16.71 IC2.54
28
  Top 0.152: SV7.9 121.87,15.34 121.87,16.26 120.8,17.32 120.8,24.33 121.87,25.4 IC2.55
  Bottom 0.152: SENSOR_TT.1 115.47,87.58 115.47,86.06 115.16,85.75 115.16,81.03 114.25,80.11 114.25,69.75 118.21,65.79 119.89,65.79 123.39,62.28 123.39,32.11 122.02,30.73 122.02,25.4 IC2.55
29
  Top 0.152: HBS_Y_L.3 108,3.91 112.73,3.91 115.01,1.63 120.65,1.63 124.31,5.28 124.31,10.31 SV7.10 122.02,12.75 122.94,13.66 122.94,15.65 122.02,16.56 122.02,22.81 IC2.56
30  (via drill 0.35)
  Top 0.152: SV7.11 119.28,15.34 119.28,16.41 118.36,17.32 118.36,24.49 119.28,25.4 IC2.57 | IC3.7 36.98,82.4 31.5,82.4 30.58,81.48 30.58,78.59 37.14,72.03 41.71,72.03 46.74,67 58.78,67 75.39,50.39 75.39,45.52 76.61,44.3 86.05,44.3 v91.08,39.27
  Bottom 0.152: v91.08,39.27 93.83,36.52 93.83,35.61 97.18,32.26 109.98,32.26 113.79,28.45 116.23,28.45 119.28,25.4 IC2.57
31
  Top 0.152: SV7.12 120.5,13.82 120.5,15.65 119.43,16.71 119.43,22.81 IC2.58
  Bottom 0.152: HBS_Y_L.2 105.41,4.37 112.12,11.07 117.75,11.07 SV7.12
32  (via drill 0.35)
  Top 0.152: SV7.13 116.84,16.26 115.77,17.32 115.77,24.33 IC2.59 | v69.29,57.4 59.39,67.31 46.89,67.31 41.86,72.34 39.42,72.34 33.02,78.74 33.02,81.33 33.78,82.09 34.85,82.09 36.83,80.11 IC3.5 | v68.38,56.49 68.38,50.09 76.76,41.71 84.99,41.71 v90.93,35.76
  Bottom 0.152: v68.38,56.49 v69.29,57.4 | v90.93,35.76 91.85,35.76 99.62,27.99 113.03,27.99 113.18,28.14 114.1,28.14 IC2.59
33
  Top 0.152: IC2.60 116.84,16.71 117.91,15.65 117.91,13.82 116.84,12.75 SV7.14
  Bottom 0.152: HBS_Y_L.1 102.97,3.91 102.97,4.52 109.83,11.38 115.62,11.38 116.84,12.6 SV7.14
34
  Top 0.152: SV7.15 114.25,15.34 114.25,19 113.18,20.07 113.18,24.33 114.25,25.4 IC2.61
  Bottom 0.152: IC5.10 45.82,30.43 45.82,29.67 47.65,27.84 74.93,27.84 76.15,26.62 88.04,26.62 88.8,27.38 112.27,27.38 114.25,25.4 IC2.61
35  (via drill 0.35)
  Top 0.152: v123.7,5.89 121.11,5.89 SV7.16 114.4,12.75 115.32,13.66 115.32,18.39 114.4,19.3 114.4,22.81 IC2.62
  Bottom 0.152: v123.7,5.89 129.34,5.89 130.71,4.52 130.71,3.91 HBS_X.2
36  (via drill 0.35)
  Top 0.152: v50.39,33.17 60.91,33.17 62.28,34.54 68.68,34.54 76.45,26.77 v90.93,26.77
  Bottom 0.152: 111.66,25.4 110.44,24.18 110.44,22.2 111.81,20.83 111.81,15.34 SV7.17 | IC5.12 48.26,31.04 v50.39,33.17 | v90.93,26.77 110.29,26.77 111.66,25.4 | 111.66,25.4 IC2.63
37
  Top 0.152: HBS_X.1 128.27,10.01 125.83,12.45 125.83,25.55 123.24,28.14 113.18,28.14 112.88,27.84 112.88,24.03 111.81,22.96 IC2.64 111.66,22.81 110.74,21.89 110.74,14.73 111.66,13.82 111.66,12.75 SV7.18
38
  Top 0.152: IC2.65 110.29,24.33 110.29,22.5 109.22,21.44 SV7.19 109.22,15.19 110.29,14.12 110.29,12.75 115.47,7.57 115.47,3.91 HBS_Y_R.1
39  (via drill 0.35)
  Top 0.152: v116.08,37.44 118.06,39.42 120.8,39.42 123.09,41.71 139.24,41.71 140.61,43.08 140.61,87.73 139.7,88.65 137.72,88.65 136.65,89.71 136.65,90.32 133.15,93.83 131.32,93.83 127.81,97.33 122.48,97.33 118.21,101.6 SENSOR5.1 | v111.66,33.02 111.66,29.36 108.15,25.86 108.15,24.03 109.22,22.96 IC2.66
  Bottom 0.152: SV7.20 109.22,12.75 108,13.97 108,21.59 109.22,22.81 IC2.66 | v111.66,33.02 v116.08,37.44
40
  Top 0.152: 106.17,24.94 106.63,25.4 IC2.67 106.17,24.94 | 106.17,24.94 105.56,24.33 105.56,20.52 106.63,19.46 106.63,15.34 SV7.21 | 106.17,24.94 108,23.11 108,9.09 115.16,1.93 118.52,1.93 120.35,3.76 120.65,3.76 HBS_Y_R.3
41
  Top 0.152: HBS_Z.3 95.35,3.91 97.94,3.91 106.63,12.6 SV7.22 106.78,12.75 107.7,13.66 107.7,18.85 106.78,19.76 106.78,22.81 IC2.68
42  (via drill 0.35)
  Top 0.152: SV7.23 104.04,15.34 104.04,16.41 103.12,17.32 103.12,24.49 104.04,25.4 IC2.69 104.19,25.4 105.72,26.92 v105.72,28.6 | v54.81,77.98 56.64,77.98 75.69,58.93 75.69,52.83 76.61,51.92 84.99,51.92 92.3,44.6 v92.3,37.13
  Bottom 0.152: v54.81,77.98 50.24,82.55 45.21,82.55 44.45,83.31 44.45,83.46 43.23,84.68 43.23,84.99 IC3.10 | v92.3,37.13 92.3,36.68 97.03,31.95 102.36,31.95 v105.72,28.6
43
  Top 0.152: HBS_Z.2 92.76,3.91 93.07,3.91 99.92,10.77 102.21,10.77 SV7.24 105.26,13.82 105.26,15.65 104.19,16.71 104.19,22.81 IC2.70
44  (via drill 0.35)
  Top 0.152: SV7.25 101.6,19.61 100.53,20.68 100.53,24.33 IC2.71 v110.13,33.93
  Bottom 0.152: v110.13,33.93 112.27,36.07 112.27,86.97 115.16,89.87 115.16,93.37 115.47,93.67 115.47,95.2 SENSOR_SRB.1
45
  Top 0.152: HBS_Z.1 90.17,3.91 90.63,3.91 98.1,11.38 100.38,11.38 101.6,12.6 SV7.26 101.6,12.75 102.67,13.82 102.67,19 101.6,20.07 IC2.72
46  (via drill 0.35)
  Top 0.152: 99.01,25.4 97.94,24.33 97.94,20.68 99.01,19.61 99.01,15.34 SV7.27 | v56.34,77.37 56.34,72.64 75.39,53.59 75.39,50.85 75.69,50.55 75.69,50.39 79.35,46.74 84.99,46.74 91.69,40.03 v91.69,36.37 | v97.18,31.34 97.18,27.23 99.01,25.4 | 99.01,25.4 IC2.73
  Bottom 0.152: v56.34,77.37 50.85,82.86 47.35,82.86 45.82,84.38 45.82,84.99 IC3.12 | v91.69,36.37 92.15,36.37 v97.18,31.34
47
  Top 0.152: HBS_Z1.2 82.55,3.91 88.04,3.91 95.81,11.68 98.1,11.68 99.01,12.6 SV7.28 99.16,12.75 100.08,13.66 100.08,19 99.16,19.91 99.16,22.81 IC2.74
48
  Top 0.152: SV7.29 95.5,16.26 95.5,23.27 96.42,24.18 96.42,25.4 IC2.75
  Bottom 0.152: HBS_Y_R.2 117.45,3.15 117.3,3.15 116.84,2.69 116.84,2.39 116.08,1.63 102.36,1.63 97.79,6.2 97.79,11.99 97.64,12.14 97.64,13.21 97.79,13.36 97.79,13.97 SV7.29
49
  Top 0.152: IC2.76 97.64,21.74 97.64,14.88 96.57,13.82 96.57,12.75 SV7.30
A0
  Top 0.152: SV5.8 77.52,68.53 83.77,68.53 IC2.7
A1
  Top 0.152: SV5.7 77.52,66.09 83.77,66.09 IC2.8
A2
  Top 0.152: IC2.9 SV5.6
A3
  Top 0.152: SV5.5 77.52,60.91 83.77,60.91 IC2.10
A4
  Top 0.152: SV5.4 77.52,58.47 83.77,58.47 IC2.11
A5
  Top 0.152: IC2.12 SV5.3
A6
  Top 0.152: SV5.2 77.52,53.29 83.77,53.29 IC2.13
A7
  Top 0.152: SV5.1 77.52,50.85 83.77,50.85 IC2.14
A8
  Top 0.152: SV6.8 77.52,45.67 83.77,45.67 IC2.15
A9
  Top 0.152: SV6.7 77.52,43.23 83.77,43.23 IC2.16
A10
  Top 0.152: IC2.17 SV6.6
A11
  Top 0.152: SV6.5 77.52,38.05 83.77,38.05 IC2.18
A12
  Top 0.152: SV6.4 77.52,35.61 83.77,35.61 IC2.19
A13
  Top 0.152: IC2.20 SV6.3
A14
  Top 0.152: SV6.2 77.52,30.43 83.77,30.43 IC2.21
A15
  Top 0.152: SV6.1 77.52,27.99 83.77,27.99 IC2.22
AREF
  Top 0.152: IC2.46 132.08,95.2 138.33,95.2 SV3.8
GND
  pour Bottom: 0,120.65 77.47,120.65 77.47,106.68 142.24,106.68 142.24,0 0,0
MISO
  Top 0.152: SV7.31 93.98,21.44 92.91,22.5 92.91,24.33 IC2.77 96.27,27.69 96.27,60.15 95.35,61.06 95.35,62.13 NRF.2
MOSI
  Top 0.152: SV7.32 93.98,13.82 95.05,14.88 95.05,21.74 93.98,22.81 IC2.78 93.98,22.96 95.05,24.03 95.05,25.4 96.57,26.92 96.57,47.65 97.79,48.87 NRF.3
N$1
  Top 0.152: 30.58,99.16 31.65,99.16 D2.C | 30.58,99.16 27.99,99.16 D1.A | MOTOR1.1 62.13,114.25 35.46,114.25 33.02,111.81 IC1.2 33.02,111.66 30.58,109.22 30.58,99.16
N$2
  Top 0.152: 44.45,99.16 46.89,99.16 D4.C 47.04,99.16 50.24,99.16 64.72,113.64 64.72,114.25 MOTOR1.2 | 44.45,99.16 41.71,99.16 35.61,105.26 35.61,105.41 34.39,106.63 IC1.3 | 44.45,99.16 D3.A
N$3
  Top 0.152: D8.C 26.62,93.98 27.53,93.07 30.73,93.07 | 30.73,93.07 43.54,93.07 D6.A | 64.87,108.46 64.87,112.12 65.79,113.03 65.79,115.47 65.18,116.08 64.26,116.08 63.65,115.47 63.65,113.03 62.43,111.81 48.26,111.81 IC1.14 | 64.87,108.46 64.87,106.78 MOTOR2.2 | 30.73,93.07 30.73,94.28 33.93,97.48 49.17,97.48 60.15,108.46 64.87,108.46
N$4
  Top 0.152: D7.C 35.46,93.98 36.68,95.2 50.7,95.2 | 50.7,95.2 50.85,95.2 D5.A | 50.7,95.2 62.13,106.63 MOTOR2.1
  Bottom 0.152: D5.A 50.7,95.35 50.7,101.3 47.04,104.95 47.04,106.63 IC1.13
N$5
  Top 0.152: R1.1 102.97,86.36 102.97,80.11 ESP8266.1
N$7
  Top 0.152: D10.C 30.28,71.12 | 30.28,71.12 D9.A | MOTOR3.1 52.07,86.36 48.72,83.01 35,83.01 33.33,84.68 | 33.33,84.68 33.02,84.99 IC3.2 33.33,84.68 | 30.28,71.12 30.28,81.64 33.33,84.68
N$8
  Top 0.152: MOTOR3.2 64.72,86.36 63.65,85.29 63.65,85.14 57.1,78.59 54.51,78.59 47.04,71.12 D12.C D11.A 41.86,73.71 40.49,73.71 35.61,78.59 35.61,78.74 34.39,79.96 IC3.3
N$9
  Top 0.152: 27.84,67.31 26.62,66.09 22.96,66.09 D16.C | 27.84,67.31 43.23,67.31 44.45,66.09 D14.A | 27.84,67.31 27.84,69.9 26.92,70.81 26.92,81.64 32.41,87.12 46.28,87.12 48.26,85.14 IC3.14
  Bottom 0.152: MOTOR4.2 64.72,78.74 63.5,79.96 63.5,80.11 59.23,84.38 48.87,84.38 48.26,84.99 IC3.14
N$10
  Top 0.152: D15.C 31.8,65.94 35.61,65.94 36.83,64.72 50.85,64.72 52.07,65.94 D13.A
  Bottom 0.152: 55.73,70.66 52.07,67 D13.A | 55.73,70.66 62.13,77.06 62.13,78.74 MOTOR4.1 | 55.73,70.66 55.58,70.66 47.04,79.2 47.04,79.96 IC3.13
N$11
  Top 0.152: D17.A D18.C 31.8,44.45 31.8,49.48 34.39,52.07 34.39,54.97 36.07,56.64 | IC4.2 36.07,56.64 | 36.07,56.64 36.37,56.34 50.09,56.34 52.07,58.32 62.13,58.32 MOTOR5.1
N$12
  Top 0.152: MOTOR5.2 64.72,58.32 64.72,56.19 53.9,45.36 49.17,45.36 D20.C D19.A 44.45,44.45 IC4.3
N$13
  Top 0.152: 27.84,40.64 26.62,39.42 22.96,39.42 D24.C | 27.84,40.64 44.45,40.64 D22.A 45.82,39.42 46.74,40.34 54.05,40.34 64.41,50.7 64.72,50.7 MOTOR6.2 | IC4.14 47.5,60.45 33.78,60.45 26.92,53.59 26.92,41.55 27.84,40.64
N$14
  Top 0.152: D23.C 31.8,39.27 35.61,39.27 36.83,38.05 52.07,38.05 53.29,39.27 D21.A 53.44,39.42 55.58,39.42 65.79,49.63 65.79,52.07 65.18,52.68 64.41,52.68 62.59,50.85 62.28,50.85 MOTOR6.1
  Bottom 0.152: IC4.13 48.26,52.22 51.92,48.56 51.92,41.86 53.29,40.49 53.29,39.42 D21.A
N$15
  Top 0.152: MOTOR7.1 63.5,29.52 64.26,28.75 64.26,27.08 53.44,16.26 53.44,15.34 D25.A 52.38,14.27 45.36,14.27 44.45,15.19 40.64,15.19 D26.C 40.64,15.34 38.2,17.78 38.2,26.62 35.61,29.21 35.61,30.43 IC5.2
N$16
  Top 0.152: D28.C 22.96,15.19 26.62,15.19 27.53,14.27 35.92,14.27 36.83,15.19 D27.A IC5.3 34.39,27.84 34.39,31.95 35,32.56 60.76,32.56 62.43,34.24 64.11,34.24 65.94,32.41 65.94,31.8 MOTOR7.2
N$19
  Top 0.152: D32.C 26.62,10.16 27.53,9.25 44.76,9.25 45.67,10.16 D30.A 46.89,10.16 47.8,9.25 53.75,9.25 54.66,10.16 54.66,12.75 MOTOR8.2 65.94,24.18 65.94,29.67 64.87,30.73 64.87,33.02 63.96,33.93 62.59,33.93 60.91,32.26 52.53,32.26 50.85,30.58 IC5.14
N$20
  Top 0.152: D31.C 35.46,10.16 36.68,11.38 52.07,11.38 | 52.07,11.38 53.29,10.16 D29.A | 52.07,11.38 63.5,22.81 MOTOR8.1 63.5,24.18 64.57,25.25 64.57,32.87 63.8,33.63 63.2,33.63 61.52,31.95 56.03,31.95 50.85,26.77 50.85,26.62 49.63,25.4 IC5.13
R0
  Top 0.152: SV2.1 IC2.31
R1  (via drill 0.35)
  Top 0.152: R1.2 95.35,86.36 95.35,91.39 R2.1 | 132.08,38.05 122.17,38.05 119.74,35.61 119.43,35.61 SERIAL1.2 | 132.08,38.05 138.33,38.05 SV1.3 | 132.08,38.05 IC2.25 | v109.98,73.41 109.98,51.92 v114.25,47.65
  Bottom 0.152: R1.2 98.4,86.36 109.37,75.39 109.37,74.02 v109.98,73.41 | v114.25,47.65 114.25,42.16 119.28,37.13 119.28,35.61 SERIAL1.2
R2
  Top 0.152: SV1.5 138.33,43.23 132.08,43.23 IC2.27 132.08,43.08 124,43.08 122.33,41.4 121.11,41.4 119.43,43.08 SERIAL2.2 117.6,41.4 113.33,41.4 110.59,38.66 99.92,38.66 98.1,36.83 BLUETOOTH_MODULE.2
R3
  Top 0.152: SV1.7 IC2.29 122.17,48.26 119.74,50.7 119.43,50.7 SERIAL3.2
RESET
  Top 0.152: IC2.1 SV4.6
SCK
  Top 0.152: SV7.33 91.39,15.34 91.39,21.44 90.32,22.5 90.32,24.33 91.39,25.4 IC2.79 91.54,25.4 91.54,35.31 95.96,39.73 95.96,46.89 94.13,48.72 94.13,62.59 94.89,63.35 95.66,63.35 96.72,62.28 97.79,62.28 NRF.4
SCL
  Top 0.152: SV1.1 IC2.23
SDA
  Top 0.152: IC2.24 132.08,35.61 138.33,35.61 SV1.2
SS
  Top 0.152: SV7.34 91.54,12.75 91.54,13.82 92.46,14.73 92.46,21.89 91.54,22.81 IC2.80
T0
  Top 0.152: IC2.32 132.08,58.47 138.33,58.47 SV2.2
T1  (via drill 0.35)
  Top 0.152: SV1.4 IC2.26 122.48,40.64 119.28,37.44 118.67,37.44 116.84,35.61 | v111.66,38.81 113.64,38.81 116.84,35.61 | 116.84,35.61 SERIAL1.3
  Bottom 0.152: v111.66,38.81 111.66,55.42 95.35,71.73 95.35,77.37 ESP8266.8
T2  (via drill 0.35)
  Top 0.152: 132.08,45.67 138.33,45.67 SV1.6 | v97.18,38.96 110.44,38.96 114.55,43.08 116.84,43.08 SERIAL2.3 116.84,43.23 119.28,45.67 132.08,45.67 | 132.08,45.67 IC2.28
  Bottom 0.152: v97.18,38.96 96.57,38.35 96.57,38.2 95.81,37.44 95.81,37.29 95.35,36.83 BLUETOOTH_MODULE.1
T3
  Top 0.152: 132.08,50.85 130.25,52.68 118.97,52.68 117.14,50.85 116.84,50.85 SERIAL3.3 | 132.08,50.85 138.33,50.85 SV1.8 | 132.08,50.85 IC2.30
VI
  Top 0.152: SV4.1 77.52,73.71 83.77,73.71 IC2.6
VIN  (via drill 0.35)
  Top 0.152: D13.C 46.43,65.48 | 46.43,65.48 45.97,65.02 44.14,65.02 43.23,65.94 39.42,65.94 D14.C 39.27,66.09 38.05,66.09 37.14,67 31.34,67 20.37,56.03 20.37,53.44 C6.1 22.81,50.85 22.81,44.45 | D11.C 40.79,71.12 46.43,65.48 | D21.C 48.26,39.27 47.35,38.35 45.36,38.35 44.45,39.27 40.64,39.27 D22.C 40.64,39.42 39.73,40.34 31.34,40.34 29.36,38.35 22.5,38.35 21.9,38.96 21.9,39.73 22.81,40.64 22.81,44.45 | 22.81,44.45 D17.C | D9.C 22.81,71.12 22.81,77.52 C4.1 19,81.33 19,83.31 12.29,90.02 12.29,93.07 10.16,95.2 VIN.1 10.16,99.92 18.24,108 | 110.9,104.04 120.65,104.04 123.09,101.6 SENSOR5.3 | 110.9,104.04 103.43,104.04 100.99,101.6 SENSOR3.3 94.89,101.6 86.36,93.07 47.95,93.07 47.04,93.98 D5.C 46.89,93.98 45.97,94.89 43.99,94.89 43.08,93.98 D6.C | 110.9,104.04 v110.9,103.28 | 18.24,108 19,108 C2.1 | 18.24,108 14.58,111.66 12V.3 | D1.C 22.96,99.01 25.25,99.01 26.47,97.79 38.05,97.79 39.27,99.01 D3.C
  Bottom 0.152: 36.83,59.54 IC4.4 36.83,58.47 | 36.83,59.54 39.42,62.13 39.42,65.94 D14.C | D22.C D19.C | v110.9,103.28 SENSOR4.3 | 39.42,93.98 38.51,93.07 38.51,89.71 35.61,86.82 35.61,85.14 IC3.4 | 24.49,102.51 22.81,100.84 22.81,99.16 D1.C | 24.49,102.51 31.19,109.22 33.63,109.22 35.46,111.05 35.46,111.66 IC1.4 | 24.49,102.51 C2.1 | 39.42,93.98 39.42,99.01 D3.C | 39.42,93.98 D6.C | 36.83,59.54 31.65,64.72 31.19,64.72 24.79,71.12 D9.C

### Text on the board
tPlace: O | G | V | O | G | V | O | G | V | O | G | V | O | G | O | G | T | R | G | T | G | T | G | 1 | 2 | 3 | 4 | W | T | M | D | D | M | T | L | M | R